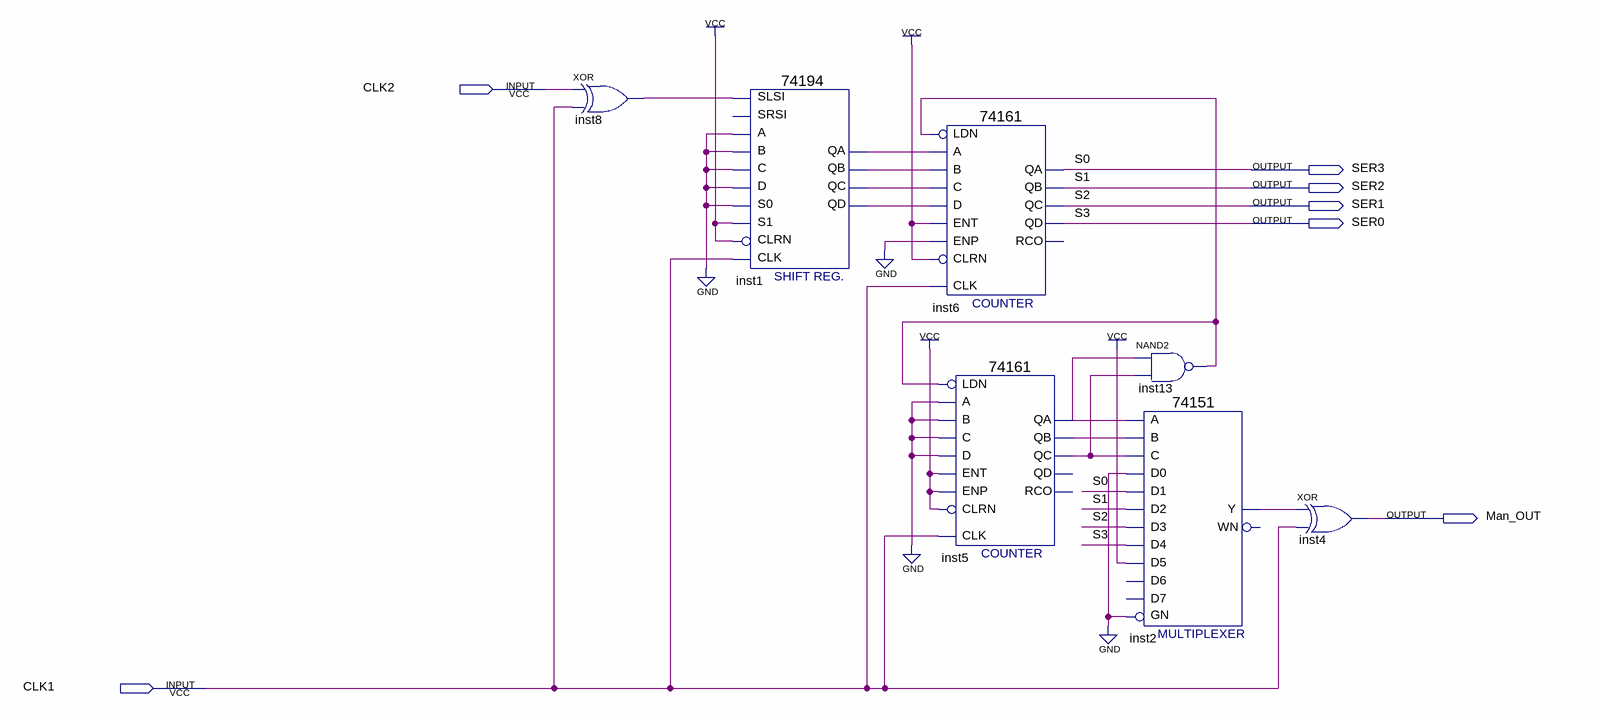
[diagram p0: schematic sheet]
// Quartus schematic 6Bit_Parallel_Serial_Manchester.bdf as structural Verilog: 7 symbols, 7 pins
module \6Bit_Parallel_Serial_Manchester  (
  input  CLK2,
  input  CLK1,
  output SER3,
  output SER2,
  output SER1,
  output SER0,
  output Man_OUT
);

  wire inst1_qa, inst1_qb, inst1_qc, inst1_qd, inst2_y, inst5_qa, inst5_qb, inst5_qc, inst8_out, inst13_out;

  xor inst8 (inst8_out, CLK2, CLK1);
  \74194  inst1 (
    .SLSI(inst8_out), .B(1'b0), .C(1'b0), .CLK(CLK1), .CLRN(1'b1), .D(1'b0), .S1(1'b1), .S0(1'b0), .A(1'b0),
    .QA(inst1_qa), .QB(inst1_qb), .QC(inst1_qc), .QD(inst1_qd));  // open: SRSI
  \74161  inst6 (
    .CLRN(1'b1), .CLK(CLK1), .ENP(1'b0), .LDN(inst13_out), .A(inst1_qa), .D(inst1_qd), .ENT(1'b1),
    .B(inst1_qb), .C(inst1_qc), .QD(SER0), .QC(SER1), .QB(SER2), .QA(SER3));  // open: RCO
  \74161  inst5 (
    .CLRN(1'b1), .CLK(CLK1), .ENP(1'b1), .LDN(inst13_out), .A(1'b0), .D(1'b0), .ENT(1'b1), .B(1'b0),
    .C(1'b0), .QC(inst5_qc), .QB(inst5_qb), .QA(inst5_qa));  // open: QD, RCO
  nand inst13 (inst13_out, inst5_qa, inst5_qc);
  \74151  inst2 (
    .GN(1'b0), .C(inst5_qc), .B(inst5_qb), .A(inst5_qa), .D5(1'b1), .D0(1'b0), .D1(SER3), .D4(SER0),
    .D3(SER1), .D2(SER2), .Y(inst2_y));  // open: D6, D7, WN
  xor inst4 (Man_OUT, inst2_y, CLK1);

  // Other names for the same wires on the sheet: S0 = SER3; S1 = SER2; S2 = SER1; S3 = SER0
endmodule
